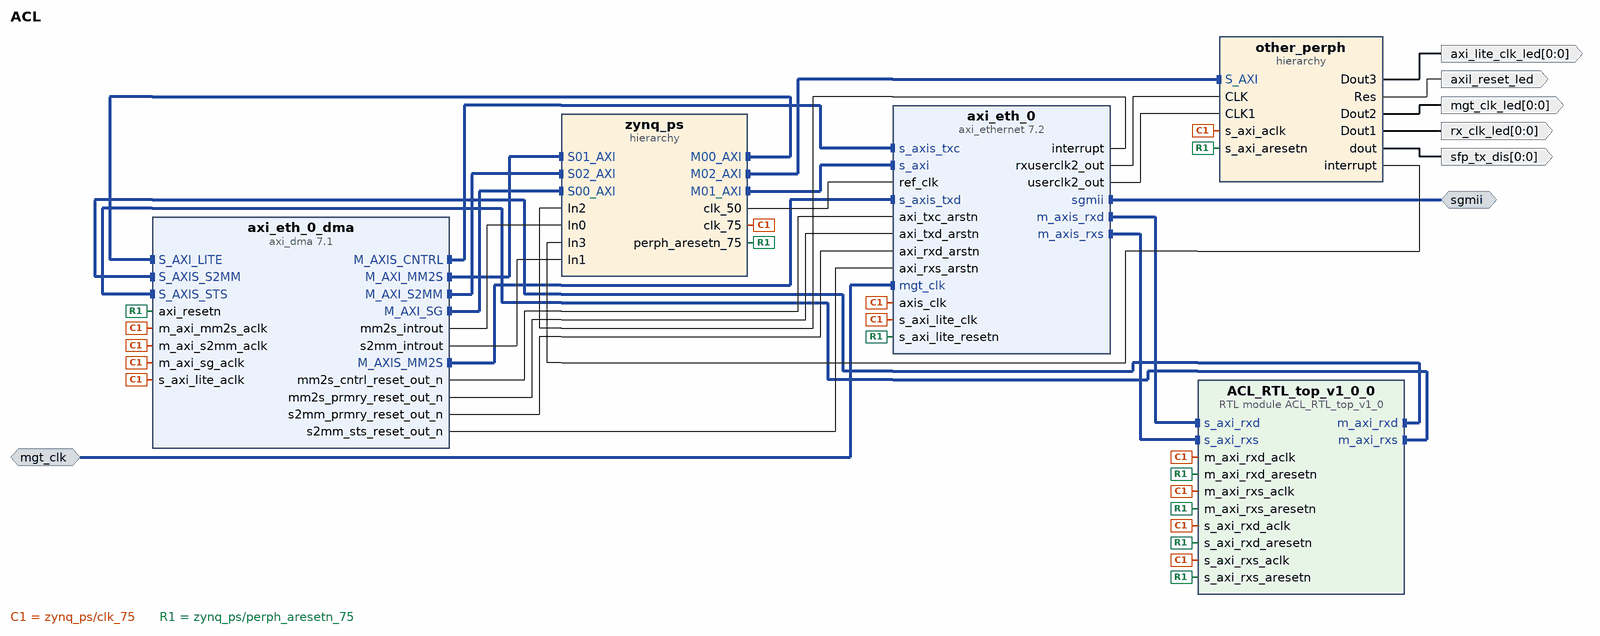
[diagram p0: block diagram of the top level]
# Vivado block design ACL, xczu9eg-ffvb1156-2-e, Vivado 2023.2
create_bd_design ACL

create_bd_intf_port -mode Slave -vlnv xilinx.com:interface:diff_clock_rtl:1.0 mgt_clk
create_bd_intf_port -mode Master -vlnv xilinx.com:interface:sgmii_rtl:1.0 sgmii
create_bd_port -dir O -from 0 -to 0 axi_lite_clk_led
create_bd_port -dir O axil_reset_led
create_bd_port -dir O -from 0 -to 0 mgt_clk_led
create_bd_port -dir O -from 0 -to 0 rx_clk_led
create_bd_port -dir O -from 0 -to 0 sfp_tx_dis

create_bd_cell -type hier other_perph
create_bd_cell -type hier zynq_ps
create_bd_cell -type ip -vlnv xilinx.com:ip:axi_ethernet:7.2 axi_eth_0
set_property -dict [list \
  CONFIG.PHYADDR 2 \
  CONFIG.PHY_TYPE SGMII \
  CONFIG.RXCSUM Full \
  CONFIG.RXMEM 32k \
  CONFIG.Statistics_Reset true \
  CONFIG.TXCSUM Full \
  CONFIG.TXMEM 32k \
  CONFIG.gtlocation X1Y13 \
  CONFIG.gtrefclkrate 156.25 \
] [get_bd_cells axi_eth_0]
create_bd_cell -type ip -vlnv xilinx.com:ip:axi_dma:7.1 axi_eth_0_dma
set_property -dict [list \
  CONFIG.c_include_mm2s_dre 1 \
  CONFIG.c_include_s2mm_dre 1 \
  CONFIG.c_sg_length_width 16 \
  CONFIG.c_sg_use_stsapp_length 1 \
] [get_bd_cells axi_eth_0_dma]
create_bd_cell -type module -reference ACL_RTL_top_v1_0 ACL_RTL_top_v1_0_0

# ---- hierarchy /other_perph ----
current_bd_instance /other_perph
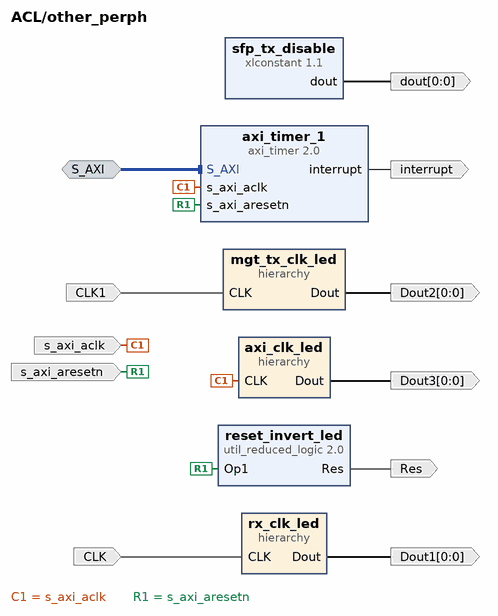
[diagram p1: block diagram inside /other_perph]
create_bd_intf_pin -mode Slave -vlnv xilinx.com:interface:aximm_rtl:1.0 S_AXI
create_bd_pin -dir I -type clk CLK
create_bd_pin -dir I -type clk CLK1
create_bd_pin -dir O -from 0 -to 0 Dout1
create_bd_pin -dir O -from 0 -to 0 Dout2
create_bd_pin -dir O -from 0 -to 0 Dout3
create_bd_pin -dir O Res
create_bd_pin -dir O -from 0 -to 0 dout
create_bd_pin -dir O -type intr interrupt
create_bd_pin -dir I -type clk s_axi_aclk
create_bd_pin -dir I -type rst s_axi_aresetn

create_bd_cell -type hier axi_clk_led
create_bd_cell -type hier mgt_tx_clk_led
create_bd_cell -type ip -vlnv xilinx.com:ip:util_reduced_logic:2.0 reset_invert_led
set_property -dict {CONFIG.C_SIZE 1} [get_bd_cells reset_invert_led]
create_bd_cell -type hier rx_clk_led
create_bd_cell -type ip -vlnv xilinx.com:ip:axi_timer:2.0 axi_timer_1
create_bd_cell -type ip -vlnv xilinx.com:ip:xlconstant:1.1 sfp_tx_disable
set_property -dict {CONFIG.CONST_VAL 1 CONFIG.CONST_WIDTH 1} [get_bd_cells sfp_tx_disable]

# ---- hierarchy /other_perph/axi_clk_led ----
current_bd_instance /other_perph/axi_clk_led
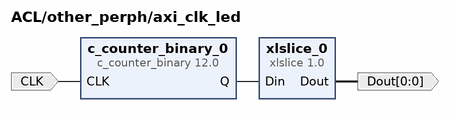
[diagram p2: block diagram inside /other_perph/axi_clk_led]
create_bd_pin -dir I -type clk CLK
create_bd_pin -dir O -from 0 -to 0 Dout

create_bd_cell -type ip -vlnv xilinx.com:ip:xlslice:1.0 xlslice_0
set_property -dict {CONFIG.DIN_FROM 24 CONFIG.DIN_TO 24 CONFIG.DOUT_WIDTH 1} [get_bd_cells xlslice_0]
create_bd_cell -type ip -vlnv xilinx.com:ip:c_counter_binary:12.0 c_counter_binary_0
set_property -dict {CONFIG.Output_Width 32 CONFIG.Restrict_Count false} [get_bd_cells c_counter_binary_0]

# ---- hierarchy /other_perph/mgt_tx_clk_led ----
current_bd_instance /other_perph/mgt_tx_clk_led
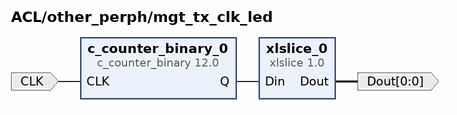
[diagram p3: block diagram inside /other_perph/mgt_tx_clk_led]
create_bd_pin -dir I -type clk CLK
create_bd_pin -dir O -from 0 -to 0 Dout

create_bd_cell -type ip -vlnv xilinx.com:ip:xlslice:1.0 xlslice_0
set_property -dict {CONFIG.DIN_FROM 24 CONFIG.DIN_TO 24 CONFIG.DOUT_WIDTH 1} [get_bd_cells xlslice_0]
create_bd_cell -type ip -vlnv xilinx.com:ip:c_counter_binary:12.0 c_counter_binary_0
set_property -dict {CONFIG.Output_Width 32 CONFIG.Restrict_Count false} [get_bd_cells c_counter_binary_0]

# ---- hierarchy /other_perph/rx_clk_led ----
current_bd_instance /other_perph/rx_clk_led
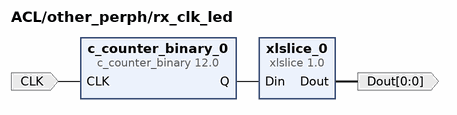
[diagram p4: block diagram inside /other_perph/rx_clk_led]
create_bd_pin -dir I -type clk CLK
create_bd_pin -dir O -from 0 -to 0 Dout

create_bd_cell -type ip -vlnv xilinx.com:ip:xlslice:1.0 xlslice_0
set_property -dict {CONFIG.DIN_FROM 24 CONFIG.DIN_TO 24 CONFIG.DOUT_WIDTH 1} [get_bd_cells xlslice_0]
create_bd_cell -type ip -vlnv xilinx.com:ip:c_counter_binary:12.0 c_counter_binary_0
set_property -dict {CONFIG.Output_Width 32 CONFIG.Restrict_Count false} [get_bd_cells c_counter_binary_0]

# ---- hierarchy /zynq_ps ----
current_bd_instance /zynq_ps
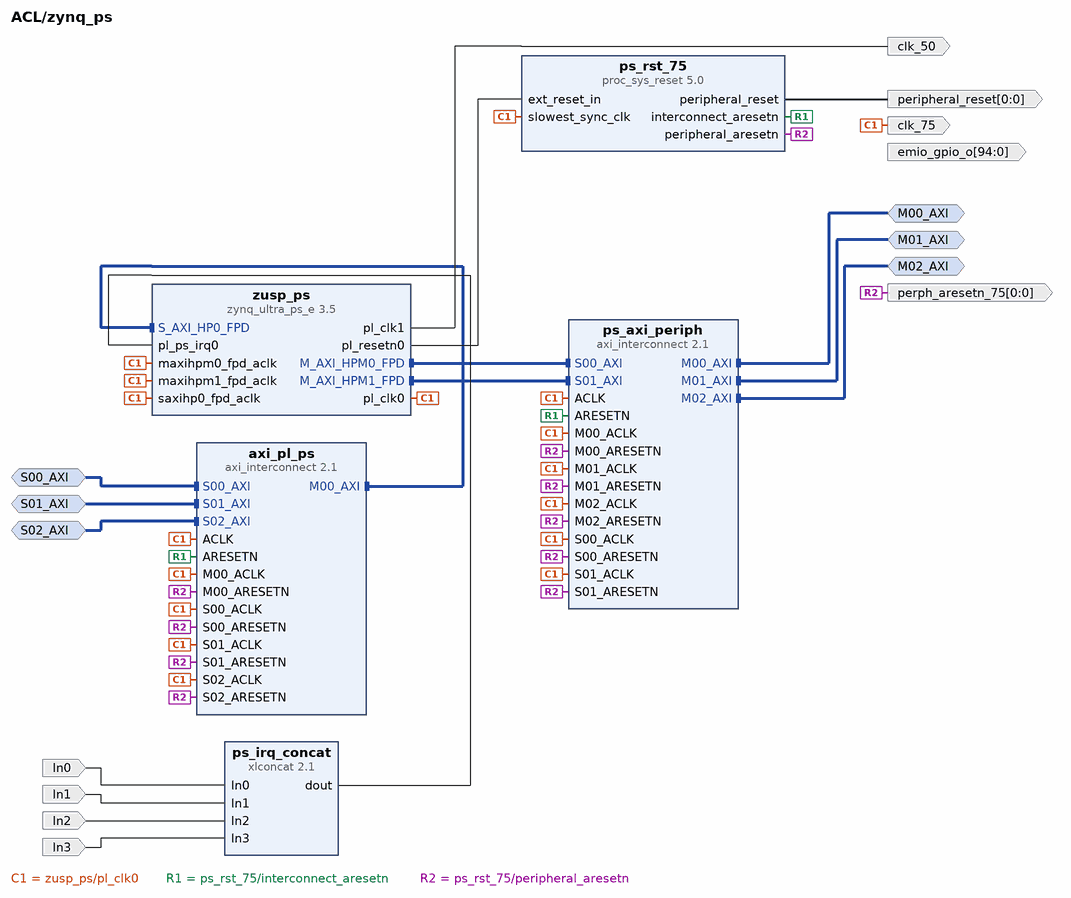
[diagram p5: block diagram inside /zynq_ps]
create_bd_intf_pin -mode Master -vlnv xilinx.com:interface:aximm_rtl:1.0 M00_AXI
create_bd_intf_pin -mode Master -vlnv xilinx.com:interface:aximm_rtl:1.0 M01_AXI
create_bd_intf_pin -mode Master -vlnv xilinx.com:interface:aximm_rtl:1.0 M02_AXI
create_bd_intf_pin -mode Slave -vlnv xilinx.com:interface:aximm_rtl:1.0 S00_AXI
create_bd_intf_pin -mode Slave -vlnv xilinx.com:interface:aximm_rtl:1.0 S01_AXI
create_bd_intf_pin -mode Slave -vlnv xilinx.com:interface:aximm_rtl:1.0 S02_AXI
create_bd_pin -dir I In0
create_bd_pin -dir I In1
create_bd_pin -dir I In2
create_bd_pin -dir I In3
create_bd_pin -dir O -type clk clk_50
create_bd_pin -dir O -type clk clk_75
create_bd_pin -dir O -from 94 -to 0 emio_gpio_o
create_bd_pin -dir O -from 0 -to 0 -type rst peripheral_reset
create_bd_pin -dir O -from 0 -to 0 -type rst perph_aresetn_75

create_bd_cell -type ip -vlnv xilinx.com:ip:xlconcat:2.1 ps_irq_concat
set_property -dict {CONFIG.NUM_PORTS 4} [get_bd_cells ps_irq_concat]
create_bd_cell -type ip -vlnv xilinx.com:ip:proc_sys_reset:5.0 ps_rst_75
create_bd_cell -type ip -vlnv xilinx.com:ip:axi_interconnect:2.1 axi_pl_ps
set_property -dict {CONFIG.NUM_MI 1 CONFIG.NUM_SI 3} [get_bd_cells axi_pl_ps]
create_bd_cell -type ip -vlnv xilinx.com:ip:axi_interconnect:2.1 ps_axi_periph
set_property -dict {CONFIG.NUM_MI 3 CONFIG.NUM_SI 2} [get_bd_cells ps_axi_periph]
create_bd_cell -type ip -vlnv xilinx.com:ip:zynq_ultra_ps_e:3.5 zusp_ps
set_property -dict [list \
  CONFIG.CAN0_BOARD_INTERFACE custom \
  CONFIG.CAN1_BOARD_INTERFACE custom \
  CONFIG.CSU_BOARD_INTERFACE custom \
  CONFIG.DP_BOARD_INTERFACE custom \
  CONFIG.GEM0_BOARD_INTERFACE custom \
  CONFIG.GEM1_BOARD_INTERFACE custom \
  CONFIG.GEM2_BOARD_INTERFACE custom \
  CONFIG.GEM3_BOARD_INTERFACE custom \
  CONFIG.GPIO_BOARD_INTERFACE custom \
  CONFIG.IIC0_BOARD_INTERFACE custom \
  CONFIG.IIC1_BOARD_INTERFACE custom \
  CONFIG.NAND_BOARD_INTERFACE custom \
  CONFIG.PCIE_BOARD_INTERFACE custom \
  CONFIG.PJTAG_BOARD_INTERFACE custom \
  CONFIG.PMU_BOARD_INTERFACE custom \
  CONFIG.PSU_BANK_0_IO_STANDARD LVCMOS18 \
  CONFIG.PSU_BANK_1_IO_STANDARD LVCMOS18 \
  CONFIG.PSU_BANK_2_IO_STANDARD LVCMOS18 \
  CONFIG.PSU_BANK_3_IO_STANDARD LVCMOS18 \
  CONFIG.PSU_DYNAMIC_DDR_CONFIG_EN 1 \
  CONFIG.PSU_USB3__DUAL_CLOCK_ENABLE 1 \
  CONFIG.PSU__CAN1__PERIPHERAL__ENABLE 1 \
  CONFIG.PSU__CAN1__PERIPHERAL__IO {MIO 24 .. 25} \
  CONFIG.PSU__CRF_APB__ACPU_CTRL__FREQMHZ 1200 \
  CONFIG.PSU__CRF_APB__ACPU_CTRL__SRCSEL APLL \
  CONFIG.PSU__CRF_APB__APLL_CTRL__SRCSEL PSS_REF_CLK \
  CONFIG.PSU__CRF_APB__DBG_FPD_CTRL__FREQMHZ 250 \
  CONFIG.PSU__CRF_APB__DBG_FPD_CTRL__SRCSEL IOPLL \
  CONFIG.PSU__CRF_APB__DBG_TRACE_CTRL__FREQMHZ 250 \
  CONFIG.PSU__CRF_APB__DBG_TRACE_CTRL__SRCSEL IOPLL \
  CONFIG.PSU__CRF_APB__DBG_TSTMP_CTRL__FREQMHZ 250 \
  CONFIG.PSU__CRF_APB__DBG_TSTMP_CTRL__SRCSEL IOPLL \
  CONFIG.PSU__CRF_APB__DDR_CTRL__FREQMHZ 1067 \
  CONFIG.PSU__CRF_APB__DDR_CTRL__SRCSEL DPLL \
  CONFIG.PSU__CRF_APB__DPDMA_REF_CTRL__FREQMHZ 600 \
  CONFIG.PSU__CRF_APB__DPDMA_REF_CTRL__SRCSEL APLL \
  CONFIG.PSU__CRF_APB__DPLL_CTRL__SRCSEL PSS_REF_CLK \
  CONFIG.PSU__CRF_APB__DP_AUDIO_REF_CTRL__SRCSEL RPLL \
  CONFIG.PSU__CRF_APB__DP_STC_REF_CTRL__SRCSEL RPLL \
  CONFIG.PSU__CRF_APB__DP_VIDEO_REF_CTRL__SRCSEL VPLL \
  CONFIG.PSU__CRF_APB__GDMA_REF_CTRL__FREQMHZ 600 \
  CONFIG.PSU__CRF_APB__GDMA_REF_CTRL__SRCSEL APLL \
  CONFIG.PSU__CRF_APB__GPU_REF_CTRL__FREQMHZ 500 \
  CONFIG.PSU__CRF_APB__GPU_REF_CTRL__SRCSEL IOPLL \
  CONFIG.PSU__CRF_APB__TOPSW_LSBUS_CTRL__FREQMHZ 100 \
  CONFIG.PSU__CRF_APB__TOPSW_LSBUS_CTRL__SRCSEL IOPLL \
  CONFIG.PSU__CRF_APB__TOPSW_MAIN_CTRL__FREQMHZ 533.33 \
  CONFIG.PSU__CRF_APB__TOPSW_MAIN_CTRL__SRCSEL DPLL \
  CONFIG.PSU__CRF_APB__VPLL_CTRL__SRCSEL PSS_REF_CLK \
  CONFIG.PSU__CRL_APB__ADMA_REF_CTRL__FREQMHZ 500 \
  CONFIG.PSU__CRL_APB__ADMA_REF_CTRL__SRCSEL IOPLL \
  CONFIG.PSU__CRL_APB__CAN1_REF_CTRL__FREQMHZ 100 \
  CONFIG.PSU__CRL_APB__CAN1_REF_CTRL__SRCSEL IOPLL \
  CONFIG.PSU__CRL_APB__CPU_R5_CTRL__FREQMHZ 500 \
  CONFIG.PSU__CRL_APB__CPU_R5_CTRL__SRCSEL IOPLL \
  CONFIG.PSU__CRL_APB__CSU_PLL_CTRL__FREQMHZ 400 \
  CONFIG.PSU__CRL_APB__CSU_PLL_CTRL__SRCSEL RPLL \
  CONFIG.PSU__CRL_APB__DBG_LPD_CTRL__FREQMHZ 250 \
  CONFIG.PSU__CRL_APB__DBG_LPD_CTRL__SRCSEL IOPLL \
  CONFIG.PSU__CRL_APB__GEM3_REF_CTRL__FREQMHZ 125 \
  CONFIG.PSU__CRL_APB__GEM3_REF_CTRL__SRCSEL IOPLL \
  CONFIG.PSU__CRL_APB__I2C0_REF_CTRL__FREQMHZ 100 \
  CONFIG.PSU__CRL_APB__I2C0_REF_CTRL__SRCSEL IOPLL \
  CONFIG.PSU__CRL_APB__I2C1_REF_CTRL__FREQMHZ 100 \
  CONFIG.PSU__CRL_APB__I2C1_REF_CTRL__SRCSEL IOPLL \
  CONFIG.PSU__CRL_APB__IOPLL_CTRL__SRCSEL PSS_REF_CLK \
  CONFIG.PSU__CRL_APB__IOU_SWITCH_CTRL__FREQMHZ 250 \
  CONFIG.PSU__CRL_APB__IOU_SWITCH_CTRL__SRCSEL IOPLL \
  CONFIG.PSU__CRL_APB__LPD_LSBUS_CTRL__FREQMHZ 100 \
  CONFIG.PSU__CRL_APB__LPD_LSBUS_CTRL__SRCSEL IOPLL \
  CONFIG.PSU__CRL_APB__LPD_SWITCH_CTRL__FREQMHZ 500 \
  CONFIG.PSU__CRL_APB__LPD_SWITCH_CTRL__SRCSEL IOPLL \
  CONFIG.PSU__CRL_APB__PCAP_CTRL__FREQMHZ 200 \
  CONFIG.PSU__CRL_APB__PCAP_CTRL__SRCSEL IOPLL \
  CONFIG.PSU__CRL_APB__PL0_REF_CTRL__FREQMHZ 100 \
  CONFIG.PSU__CRL_APB__PL0_REF_CTRL__SRCSEL IOPLL \
  CONFIG.PSU__CRL_APB__PL1_REF_CTRL__FREQMHZ 50 \
  CONFIG.PSU__CRL_APB__QSPI_REF_CTRL__FREQMHZ 125 \
  CONFIG.PSU__CRL_APB__QSPI_REF_CTRL__SRCSEL IOPLL \
  CONFIG.PSU__CRL_APB__RPLL_CTRL__SRCSEL PSS_REF_CLK \
  CONFIG.PSU__CRL_APB__SDIO1_REF_CTRL__FREQMHZ 200 \
  CONFIG.PSU__CRL_APB__SDIO1_REF_CTRL__SRCSEL IOPLL \
  CONFIG.PSU__CRL_APB__TIMESTAMP_REF_CTRL__FREQMHZ 100 \
  CONFIG.PSU__CRL_APB__TIMESTAMP_REF_CTRL__SRCSEL IOPLL \
  CONFIG.PSU__CRL_APB__UART0_REF_CTRL__FREQMHZ 100 \
  CONFIG.PSU__CRL_APB__UART0_REF_CTRL__SRCSEL IOPLL \
  CONFIG.PSU__CRL_APB__UART1_REF_CTRL__FREQMHZ 100 \
  CONFIG.PSU__CRL_APB__UART1_REF_CTRL__SRCSEL IOPLL \
  CONFIG.PSU__CRL_APB__USB0_BUS_REF_CTRL__FREQMHZ 250 \
  CONFIG.PSU__CRL_APB__USB0_BUS_REF_CTRL__SRCSEL IOPLL \
  CONFIG.PSU__CRL_APB__USB3_DUAL_REF_CTRL__FREQMHZ 20 \
  CONFIG.PSU__CRL_APB__USB3_DUAL_REF_CTRL__SRCSEL IOPLL \
  CONFIG.PSU__CRL_APB__USB3__ENABLE 1 \
  CONFIG.PSU__CSUPMU__PERIPHERAL__VALID 1 \
  CONFIG.PSU__DDRC__BUS_WIDTH {64 Bit} \
  CONFIG.PSU__DDRC__COMPONENTS UDIMM \
  CONFIG.PSU__DDRC__DEVICE_CAPACITY {4096 MBits} \
  CONFIG.PSU__DDRC__DRAM_WIDTH {8 Bits} \
  CONFIG.PSU__DDRC__ECC Disabled \
  CONFIG.PSU__DDRC__FREQ_MHZ 1066.50 \
  CONFIG.PSU__DDRC__MEMORY_TYPE {DDR 4} \
  CONFIG.PSU__DDRC__SPEED_BIN DDR4_2133P \
  CONFIG.PSU__DDR_HIGH_ADDRESS_GUI_ENABLE 1 \
  CONFIG.PSU__DDR__INTERFACE__FREQMHZ 533.500 \
  CONFIG.PSU__DEVICE_TYPE EG \
  CONFIG.PSU__DISPLAYPORT__LANE0__ENABLE 1 \
  CONFIG.PSU__DISPLAYPORT__LANE0__IO {GT Lane1} \
  CONFIG.PSU__DISPLAYPORT__LANE1__ENABLE 0 \
  CONFIG.PSU__DISPLAYPORT__PERIPHERAL__ENABLE 1 \
  CONFIG.PSU__DLL__ISUSED 1 \
  CONFIG.PSU__DPAUX__PERIPHERAL__ENABLE 1 \
  CONFIG.PSU__DPAUX__PERIPHERAL__IO {MIO 27 .. 30} \
  CONFIG.PSU__DP__LANE_SEL {Single Lower} \
  CONFIG.PSU__DP__REF_CLK_FREQ 27 \
  CONFIG.PSU__DP__REF_CLK_SEL {Ref Clk3} \
  CONFIG.PSU__ENET3__FIFO__ENABLE 0 \
  CONFIG.PSU__ENET3__GRP_MDIO__ENABLE 1 \
  CONFIG.PSU__ENET3__GRP_MDIO__IO {MIO 76 .. 77} \
  CONFIG.PSU__ENET3__PERIPHERAL__ENABLE 1 \
  CONFIG.PSU__ENET3__PERIPHERAL__IO {MIO 64 .. 75} \
  CONFIG.PSU__ENET3__PTP__ENABLE 0 \
  CONFIG.PSU__ENET3__TSU__ENABLE 0 \
  CONFIG.PSU__EXPAND__LOWER_LPS_SLAVES 1 \
  CONFIG.PSU__FPGA_PL0_ENABLE 1 \
  CONFIG.PSU__FPGA_PL1_ENABLE 1 \
  CONFIG.PSU__GEM3_COHERENCY 0 \
  CONFIG.PSU__GEM3_ROUTE_THROUGH_FPD 0 \
  CONFIG.PSU__GEM__TSU__ENABLE 0 \
  CONFIG.PSU__GPIO0_MIO__IO {MIO 0 .. 25} \
  CONFIG.PSU__GPIO0_MIO__PERIPHERAL__ENABLE 1 \
  CONFIG.PSU__GPIO1_MIO__IO {MIO 26 .. 51} \
  CONFIG.PSU__GPIO1_MIO__PERIPHERAL__ENABLE 1 \
  CONFIG.PSU__GPIO_EMIO_WIDTH 95 \
  CONFIG.PSU__GPIO_EMIO__PERIPHERAL__ENABLE 1 \
  CONFIG.PSU__GPIO_EMIO__PERIPHERAL__IO 95 \
  CONFIG.PSU__GT__LINK_SPEED HBR \
  CONFIG.PSU__GT__PRE_EMPH_LVL_4 0 \
  CONFIG.PSU__GT__VLT_SWNG_LVL_4 0 \
  CONFIG.PSU__I2C0__PERIPHERAL__ENABLE 1 \
  CONFIG.PSU__I2C0__PERIPHERAL__IO {MIO 14 .. 15} \
  CONFIG.PSU__I2C1__PERIPHERAL__ENABLE 1 \
  CONFIG.PSU__I2C1__PERIPHERAL__IO {MIO 16 .. 17} \
  CONFIG.PSU__IOU_SLCR__IOU_TTC_APB_CLK__TTC0_SEL APB \
  CONFIG.PSU__IOU_SLCR__IOU_TTC_APB_CLK__TTC1_SEL APB \
  CONFIG.PSU__IOU_SLCR__IOU_TTC_APB_CLK__TTC2_SEL APB \
  CONFIG.PSU__IOU_SLCR__IOU_TTC_APB_CLK__TTC3_SEL APB \
  CONFIG.PSU__MAXIGP0__DATA_WIDTH 128 \
  CONFIG.PSU__OVERRIDE_HPX_QOS 0 \
  CONFIG.PSU__OVERRIDE__BASIC_CLOCK 0 \
  CONFIG.PSU__PCIE__BAR0_VAL 0x0 \
  CONFIG.PSU__PCIE__BAR1_VAL 0x0 \
  CONFIG.PSU__PCIE__BAR2_VAL 0x0 \
  CONFIG.PSU__PCIE__BAR3_VAL 0x0 \
  CONFIG.PSU__PCIE__BAR4_VAL 0x0 \
  CONFIG.PSU__PCIE__BAR5_VAL 0x0 \
  CONFIG.PSU__PCIE__CLASS_CODE_BASE 0x06 \
  CONFIG.PSU__PCIE__CLASS_CODE_INTERFACE 0x0 \
  CONFIG.PSU__PCIE__CLASS_CODE_SUB 0x4 \
  CONFIG.PSU__PCIE__CLASS_CODE_VALUE 0x60400 \
  CONFIG.PSU__PCIE__CRS_SW_VISIBILITY 1 \
  CONFIG.PSU__PCIE__DEVICE_ID 0xD021 \
  CONFIG.PSU__PCIE__DEVICE_PORT_TYPE {Root Port} \
  CONFIG.PSU__PCIE__EROM_VAL 0x0 \
  CONFIG.PSU__PCIE__LANE0__ENABLE 1 \
  CONFIG.PSU__PCIE__LANE0__IO {GT Lane0} \
  CONFIG.PSU__PCIE__LINK_SPEED {5.0 Gb/s} \
  CONFIG.PSU__PCIE__MAXIMUM_LINK_WIDTH x1 \
  CONFIG.PSU__PCIE__MAX_PAYLOAD_SIZE {256 bytes} \
  CONFIG.PSU__PCIE__PERIPHERAL__ENABLE 1 \
  CONFIG.PSU__PCIE__PERIPHERAL__ENDPOINT_ENABLE 0 \
  CONFIG.PSU__PCIE__PERIPHERAL__ROOTPORT_ENABLE 1 \
  CONFIG.PSU__PCIE__PERIPHERAL__ROOTPORT_IO {MIO 31} \
  CONFIG.PSU__PCIE__REF_CLK_FREQ 100 \
  CONFIG.PSU__PCIE__REF_CLK_SEL {Ref Clk0} \
  CONFIG.PSU__PCIE__REVISION_ID 0x0 \
  CONFIG.PSU__PCIE__SUBSYSTEM_ID 0x7 \
  CONFIG.PSU__PCIE__SUBSYSTEM_VENDOR_ID 0x10EE \
  CONFIG.PSU__PCIE__VENDOR_ID 0x10EE \
  CONFIG.PSU__PMU_COHERENCY 0 \
  CONFIG.PSU__PMU__AIBACK__ENABLE 0 \
  CONFIG.PSU__PMU__EMIO_GPI__ENABLE 0 \
  CONFIG.PSU__PMU__EMIO_GPO__ENABLE 0 \
  CONFIG.PSU__PMU__GPI0__ENABLE 0 \
  CONFIG.PSU__PMU__GPI1__ENABLE 0 \
  CONFIG.PSU__PMU__GPI2__ENABLE 0 \
  CONFIG.PSU__PMU__GPI3__ENABLE 0 \
  CONFIG.PSU__PMU__GPI4__ENABLE 0 \
  CONFIG.PSU__PMU__GPI5__ENABLE 0 \
  CONFIG.PSU__PMU__GPO0__ENABLE 0 \
  CONFIG.PSU__PMU__GPO1__ENABLE 0 \
  CONFIG.PSU__PMU__GPO2__ENABLE 1 \
  CONFIG.PSU__PMU__GPO2__IO {MIO 34} \
  CONFIG.PSU__PMU__GPO2__POLARITY high \
  CONFIG.PSU__PMU__GPO3__ENABLE 0 \
  CONFIG.PSU__PMU__GPO4__ENABLE 0 \
  CONFIG.PSU__PMU__GPO5__ENABLE 0 \
  CONFIG.PSU__PMU__PERIPHERAL__ENABLE 1 \
  CONFIG.PSU__PMU__PLERROR__ENABLE 0 \
  CONFIG.PSU__PRESET_APPLIED 1 \
  CONFIG.PSU__PSS_REF_CLK__FREQMHZ 33.330 \
  CONFIG.PSU__QSPI_COHERENCY 0 \
  CONFIG.PSU__QSPI_ROUTE_THROUGH_FPD 0 \
  CONFIG.PSU__QSPI__GRP_FBCLK__ENABLE 1 \
  CONFIG.PSU__QSPI__GRP_FBCLK__IO {MIO 6} \
  CONFIG.PSU__QSPI__PERIPHERAL__DATA_MODE x4 \
  CONFIG.PSU__QSPI__PERIPHERAL__ENABLE 1 \
  CONFIG.PSU__QSPI__PERIPHERAL__IO {MIO 0 .. 12} \
  CONFIG.PSU__QSPI__PERIPHERAL__MODE {Dual Parallel} \
  CONFIG.PSU__SATA__LANE1__IO {GT Lane3} \
  CONFIG.PSU__SATA__PERIPHERAL__ENABLE 1 \
  CONFIG.PSU__SATA__REF_CLK_FREQ 125 \
  CONFIG.PSU__SATA__REF_CLK_SEL {Ref Clk1} \
  CONFIG.PSU__SD0__CLK_100_SDR_OTAP_DLY 0x3 \
  CONFIG.PSU__SD0__CLK_200_SDR_OTAP_DLY 0x3 \
  CONFIG.PSU__SD0__CLK_50_DDR_ITAP_DLY 0x3D \
  CONFIG.PSU__SD0__CLK_50_DDR_OTAP_DLY 0x4 \
  CONFIG.PSU__SD0__CLK_50_SDR_ITAP_DLY 0x15 \
  CONFIG.PSU__SD0__CLK_50_SDR_OTAP_DLY 0x5 \
  CONFIG.PSU__SD1_COHERENCY 0 \
  CONFIG.PSU__SD1_ROUTE_THROUGH_FPD 0 \
  CONFIG.PSU__SD1__CLK_100_SDR_OTAP_DLY 0x3 \
  CONFIG.PSU__SD1__CLK_200_SDR_OTAP_DLY 0x3 \
  CONFIG.PSU__SD1__CLK_50_DDR_ITAP_DLY 0x3D \
  CONFIG.PSU__SD1__CLK_50_DDR_OTAP_DLY 0x4 \
  CONFIG.PSU__SD1__CLK_50_SDR_ITAP_DLY 0x15 \
  CONFIG.PSU__SD1__CLK_50_SDR_OTAP_DLY 0x5 \
  CONFIG.PSU__SD1__DATA_TRANSFER_MODE 8Bit \
  CONFIG.PSU__SD1__GRP_CD__ENABLE 1 \
  CONFIG.PSU__SD1__GRP_CD__IO {MIO 45} \
  CONFIG.PSU__SD1__GRP_POW__ENABLE 0 \
  CONFIG.PSU__SD1__GRP_WP__ENABLE 1 \
  CONFIG.PSU__SD1__GRP_WP__IO {MIO 44} \
  CONFIG.PSU__SD1__PERIPHERAL__ENABLE 1 \
  CONFIG.PSU__SD1__PERIPHERAL__IO {MIO 39 .. 51} \
  CONFIG.PSU__SD1__SLOT_TYPE {SD 3.0} \
  CONFIG.PSU__SWDT0__CLOCK__ENABLE 0 \
  CONFIG.PSU__SWDT0__PERIPHERAL__ENABLE 1 \
  CONFIG.PSU__SWDT0__RESET__ENABLE 0 \
  CONFIG.PSU__SWDT1__CLOCK__ENABLE 0 \
  CONFIG.PSU__SWDT1__PERIPHERAL__ENABLE 1 \
  CONFIG.PSU__SWDT1__RESET__ENABLE 0 \
  CONFIG.PSU__TSU__BUFG_PORT_PAIR 0 \
  CONFIG.PSU__TTC0__CLOCK__ENABLE 0 \
  CONFIG.PSU__TTC0__PERIPHERAL__ENABLE 1 \
  CONFIG.PSU__TTC0__PERIPHERAL__IO {MIO 6 .. 7} \
  CONFIG.PSU__TTC0__WAVEOUT__ENABLE 0 \
  CONFIG.PSU__TTC1__CLOCK__ENABLE 0 \
  CONFIG.PSU__TTC1__PERIPHERAL__ENABLE 1 \
  CONFIG.PSU__TTC1__PERIPHERAL__IO {MIO 12 .. 13} \
  CONFIG.PSU__TTC1__WAVEOUT__ENABLE 0 \
  CONFIG.PSU__TTC2__CLOCK__ENABLE 0 \
  CONFIG.PSU__TTC2__PERIPHERAL__ENABLE 1 \
  CONFIG.PSU__TTC2__PERIPHERAL__IO {MIO 50 .. 51} \
  CONFIG.PSU__TTC2__WAVEOUT__ENABLE 0 \
  CONFIG.PSU__TTC3__CLOCK__ENABLE 0 \
  CONFIG.PSU__TTC3__PERIPHERAL__ENABLE 1 \
  CONFIG.PSU__TTC3__PERIPHERAL__IO {MIO 56 .. 57} \
  CONFIG.PSU__TTC3__WAVEOUT__ENABLE 0 \
  CONFIG.PSU__UART0__BAUD_RATE 115200 \
  CONFIG.PSU__UART0__MODEM__ENABLE 0 \
  CONFIG.PSU__UART0__PERIPHERAL__ENABLE 1 \
  CONFIG.PSU__UART0__PERIPHERAL__IO {MIO 18 .. 19} \
  CONFIG.PSU__UART1__BAUD_RATE 115200 \
  CONFIG.PSU__UART1__MODEM__ENABLE 0 \
  CONFIG.PSU__UART1__PERIPHERAL__ENABLE 1 \
  CONFIG.PSU__UART1__PERIPHERAL__IO {MIO 20 .. 21} \
  CONFIG.PSU__USB0_COHERENCY 0 \
  CONFIG.PSU__USB0__PERIPHERAL__ENABLE 1 \
  CONFIG.PSU__USB0__PERIPHERAL__IO {MIO 52 .. 63} \
  CONFIG.PSU__USB0__REF_CLK_FREQ 26 \
  CONFIG.PSU__USB0__REF_CLK_SEL {Ref Clk2} \
  CONFIG.PSU__USB2_0__EMIO__ENABLE 0 \
  CONFIG.PSU__USB3_0__EMIO__ENABLE 0 \
  CONFIG.PSU__USB3_0__PERIPHERAL__ENABLE 1 \
  CONFIG.PSU__USB3_0__PERIPHERAL__IO {GT Lane2} \
  CONFIG.PSU__USB__RESET__MODE {Boot Pin} \
  CONFIG.PSU__USB__RESET__POLARITY {Active Low} \
  CONFIG.PSU__USE__IRQ0 1 \
  CONFIG.PSU__USE__M_AXI_GP0 1 \
  CONFIG.PSU__USE__M_AXI_GP1 1 \
  CONFIG.PSU__USE__M_AXI_GP2 0 \
  CONFIG.PSU__USE__S_AXI_GP2 1 \
  CONFIG.QSPI_BOARD_INTERFACE custom \
  CONFIG.SATA_BOARD_INTERFACE custom \
  CONFIG.SD0_BOARD_INTERFACE custom \
  CONFIG.SD1_BOARD_INTERFACE custom \
  CONFIG.SPI0_BOARD_INTERFACE custom \
  CONFIG.SPI1_BOARD_INTERFACE custom \
  CONFIG.SUBPRESET1 Custom \
  CONFIG.SUBPRESET2 Custom \
  CONFIG.SWDT0_BOARD_INTERFACE custom \
  CONFIG.SWDT1_BOARD_INTERFACE custom \
  CONFIG.TRACE_BOARD_INTERFACE custom \
  CONFIG.TTC0_BOARD_INTERFACE custom \
  CONFIG.TTC1_BOARD_INTERFACE custom \
  CONFIG.TTC2_BOARD_INTERFACE custom \
  CONFIG.TTC3_BOARD_INTERFACE custom \
  CONFIG.UART0_BOARD_INTERFACE custom \
  CONFIG.UART1_BOARD_INTERFACE custom \
  CONFIG.USB0_BOARD_INTERFACE custom \
  CONFIG.USB1_BOARD_INTERFACE custom \
] [get_bd_cells zusp_ps]
# 730 more settings of zusp_ps are not shown: defaults, MIO pin electricals, DDR timing, and values the tool derives

# ---- connections ----

current_bd_instance /other_perph
connect_bd_intf_net [get_bd_intf_pins S_AXI] [get_bd_intf_pins axi_timer_1/S_AXI]
connect_bd_net -net CLK1_1 [get_bd_pins CLK1] [get_bd_pins mgt_tx_clk_led/CLK]
connect_bd_net [get_bd_pins CLK] [get_bd_pins rx_clk_led/CLK]
connect_bd_net [get_bd_pins axi_clk_led/Dout] [get_bd_pins Dout3]
connect_bd_net [get_bd_pins axi_timer_1/interrupt] [get_bd_pins interrupt]
connect_bd_net [get_bd_pins mgt_tx_clk_led/Dout] [get_bd_pins Dout2]
connect_bd_net [get_bd_pins reset_invert_led/Res] [get_bd_pins Res]
connect_bd_net [get_bd_pins rx_clk_led/Dout] [get_bd_pins Dout1]
connect_bd_net [get_bd_pins s_axi_aclk] [get_bd_pins axi_clk_led/CLK] [get_bd_pins axi_timer_1/s_axi_aclk]
connect_bd_net [get_bd_pins s_axi_aresetn] [get_bd_pins axi_timer_1/s_axi_aresetn] [get_bd_pins reset_invert_led/Op1]
connect_bd_net [get_bd_pins sfp_tx_disable/dout] [get_bd_pins dout]

current_bd_instance /other_perph/axi_clk_led
connect_bd_net [get_bd_pins CLK] [get_bd_pins c_counter_binary_0/CLK]
connect_bd_net [get_bd_pins c_counter_binary_0/Q] [get_bd_pins xlslice_0/Din]
connect_bd_net [get_bd_pins xlslice_0/Dout] [get_bd_pins Dout]

current_bd_instance /other_perph/mgt_tx_clk_led
connect_bd_net [get_bd_pins CLK] [get_bd_pins c_counter_binary_0/CLK]
connect_bd_net [get_bd_pins c_counter_binary_0/Q] [get_bd_pins xlslice_0/Din]
connect_bd_net [get_bd_pins xlslice_0/Dout] [get_bd_pins Dout]

current_bd_instance /other_perph/rx_clk_led
connect_bd_net [get_bd_pins CLK] [get_bd_pins c_counter_binary_0/CLK]
connect_bd_net [get_bd_pins c_counter_binary_0/Q] [get_bd_pins xlslice_0/Din]
connect_bd_net [get_bd_pins xlslice_0/Dout] [get_bd_pins Dout]

current_bd_instance /zynq_ps
connect_bd_intf_net [get_bd_intf_pins S00_AXI] [get_bd_intf_pins axi_pl_ps/S00_AXI]
connect_bd_intf_net [get_bd_intf_pins ps_axi_periph/S00_AXI] [get_bd_intf_pins zusp_ps/M_AXI_HPM0_FPD]
connect_bd_intf_net [get_bd_intf_pins S01_AXI] [get_bd_intf_pins axi_pl_ps/S01_AXI]
connect_bd_intf_net [get_bd_intf_pins S02_AXI] [get_bd_intf_pins axi_pl_ps/S02_AXI]
connect_bd_intf_net [get_bd_intf_pins axi_pl_ps/M00_AXI] [get_bd_intf_pins zusp_ps/S_AXI_HP0_FPD]
connect_bd_intf_net [get_bd_intf_pins M00_AXI] [get_bd_intf_pins ps_axi_periph/M00_AXI]
connect_bd_intf_net [get_bd_intf_pins M01_AXI] [get_bd_intf_pins ps_axi_periph/M01_AXI]
connect_bd_intf_net [get_bd_intf_pins M02_AXI] [get_bd_intf_pins ps_axi_periph/M02_AXI]
connect_bd_intf_net [get_bd_intf_pins ps_axi_periph/S01_AXI] [get_bd_intf_pins zusp_ps/M_AXI_HPM1_FPD]
connect_bd_net -net ACLK_1 [get_bd_pins zusp_ps/pl_clk0] \
  [get_bd_pins clk_75] [get_bd_pins axi_pl_ps/ACLK] [get_bd_pins axi_pl_ps/S00_ACLK] [get_bd_pins axi_pl_ps/S01_ACLK] \
  [get_bd_pins axi_pl_ps/S02_ACLK] [get_bd_pins axi_pl_ps/M00_ACLK] [get_bd_pins ps_axi_periph/ACLK] \
  [get_bd_pins ps_axi_periph/S00_ACLK] [get_bd_pins ps_axi_periph/S01_ACLK] [get_bd_pins ps_axi_periph/M00_ACLK] \
  [get_bd_pins ps_axi_periph/M01_ACLK] [get_bd_pins ps_axi_periph/M02_ACLK] [get_bd_pins ps_rst_75/slowest_sync_clk] \
  [get_bd_pins zusp_ps/maxihpm0_fpd_aclk] [get_bd_pins zusp_ps/maxihpm1_fpd_aclk] [get_bd_pins zusp_ps/saxihp0_fpd_aclk]
connect_bd_net -net ARESETN_1 [get_bd_pins ps_rst_75/interconnect_aresetn] [get_bd_pins axi_pl_ps/ARESETN] [get_bd_pins ps_axi_periph/ARESETN]
connect_bd_net -net In0_1 [get_bd_pins In0] [get_bd_pins ps_irq_concat/In0]
connect_bd_net -net In1_1 [get_bd_pins In1] [get_bd_pins ps_irq_concat/In1]
connect_bd_net -net In2_1 [get_bd_pins In2] [get_bd_pins ps_irq_concat/In2]
connect_bd_net -net In3_1 [get_bd_pins In3] [get_bd_pins ps_irq_concat/In3]
connect_bd_net -net M00_ARESETN_1 [get_bd_pins ps_rst_75/peripheral_aresetn] \
  [get_bd_pins perph_aresetn_75] [get_bd_pins axi_pl_ps/S00_ARESETN] [get_bd_pins axi_pl_ps/S01_ARESETN] \
  [get_bd_pins axi_pl_ps/S02_ARESETN] [get_bd_pins axi_pl_ps/M00_ARESETN] [get_bd_pins ps_axi_periph/S00_ARESETN] \
  [get_bd_pins ps_axi_periph/S01_ARESETN] [get_bd_pins ps_axi_periph/M00_ARESETN] [get_bd_pins ps_axi_periph/M01_ARESETN] \
  [get_bd_pins ps_axi_periph/M02_ARESETN]
connect_bd_net [get_bd_pins ps_irq_concat/dout] [get_bd_pins zusp_ps/pl_ps_irq0]
connect_bd_net [get_bd_pins ps_rst_75/peripheral_reset] [get_bd_pins peripheral_reset]
connect_bd_net [get_bd_pins zusp_ps/pl_clk1] [get_bd_pins clk_50]
connect_bd_net [get_bd_pins zusp_ps/pl_resetn0] [get_bd_pins ps_rst_75/ext_reset_in]

current_bd_instance /
connect_bd_intf_net [get_bd_intf_pins ACL_RTL_top_v1_0_0/m_axi_rxd] [get_bd_intf_pins axi_eth_0_dma/S_AXIS_S2MM]
connect_bd_intf_net [get_bd_intf_pins ACL_RTL_top_v1_0_0/m_axi_rxs] [get_bd_intf_pins axi_eth_0_dma/S_AXIS_STS]
connect_bd_intf_net [get_bd_intf_pins other_perph/S_AXI] [get_bd_intf_pins zynq_ps/M02_AXI]
connect_bd_intf_net [get_bd_intf_pins axi_eth_0/s_axis_txc] [get_bd_intf_pins axi_eth_0_dma/M_AXIS_CNTRL]
connect_bd_intf_net [get_bd_intf_pins axi_eth_0/s_axis_txd] [get_bd_intf_pins axi_eth_0_dma/M_AXIS_MM2S]
connect_bd_intf_net [get_bd_intf_pins axi_eth_0_dma/M_AXI_MM2S] [get_bd_intf_pins zynq_ps/S01_AXI]
connect_bd_intf_net [get_bd_intf_pins axi_eth_0_dma/M_AXI_S2MM] [get_bd_intf_pins zynq_ps/S02_AXI]
connect_bd_intf_net [get_bd_intf_pins axi_eth_0_dma/M_AXI_SG] [get_bd_intf_pins zynq_ps/S00_AXI]
connect_bd_intf_net [get_bd_intf_pins axi_eth_0/m_axis_rxd] [get_bd_intf_pins ACL_RTL_top_v1_0_0/s_axi_rxd]
connect_bd_intf_net [get_bd_intf_pins ACL_RTL_top_v1_0_0/s_axi_rxs] [get_bd_intf_pins axi_eth_0/m_axis_rxs]
connect_bd_intf_net [get_bd_intf_ports sgmii] [get_bd_intf_pins axi_eth_0/sgmii]
connect_bd_intf_net [get_bd_intf_ports mgt_clk] [get_bd_intf_pins axi_eth_0/mgt_clk]
connect_bd_intf_net [get_bd_intf_pins axi_eth_0_dma/S_AXI_LITE] [get_bd_intf_pins zynq_ps/M00_AXI]
connect_bd_intf_net [get_bd_intf_pins axi_eth_0/s_axi] [get_bd_intf_pins zynq_ps/M01_AXI]
connect_bd_net [get_bd_pins axi_eth_0_dma/mm2s_cntrl_reset_out_n] [get_bd_pins axi_eth_0/axi_txc_arstn]
connect_bd_net [get_bd_pins axi_eth_0_dma/mm2s_introut] [get_bd_pins zynq_ps/In0]
connect_bd_net [get_bd_pins axi_eth_0_dma/mm2s_prmry_reset_out_n] [get_bd_pins axi_eth_0/axi_txd_arstn]
connect_bd_net [get_bd_pins axi_eth_0_dma/s2mm_introut] [get_bd_pins zynq_ps/In1]
connect_bd_net [get_bd_pins axi_eth_0_dma/s2mm_prmry_reset_out_n] [get_bd_pins axi_eth_0/axi_rxd_arstn]
connect_bd_net [get_bd_pins axi_eth_0_dma/s2mm_sts_reset_out_n] [get_bd_pins axi_eth_0/axi_rxs_arstn]
connect_bd_net [get_bd_pins axi_eth_0/interrupt] [get_bd_pins zynq_ps/In2]
connect_bd_net [get_bd_pins axi_eth_0/rxuserclk2_out] [get_bd_pins other_perph/CLK]
connect_bd_net [get_bd_pins axi_eth_0/userclk2_out] [get_bd_pins other_perph/CLK1]
connect_bd_net [get_bd_pins other_perph/Dout1] [get_bd_ports rx_clk_led]
connect_bd_net [get_bd_pins other_perph/Dout2] [get_bd_ports mgt_clk_led]
connect_bd_net [get_bd_pins other_perph/Dout3] [get_bd_ports axi_lite_clk_led]
connect_bd_net [get_bd_pins other_perph/Res] [get_bd_ports axil_reset_led]
connect_bd_net [get_bd_pins other_perph/dout] [get_bd_ports sfp_tx_dis]
connect_bd_net [get_bd_pins other_perph/interrupt] [get_bd_pins zynq_ps/In3]
connect_bd_net -net s_axi_aclk_1 [get_bd_pins zynq_ps/clk_75] \
  [get_bd_pins other_perph/s_axi_aclk] [get_bd_pins axi_eth_0/s_axi_lite_clk] [get_bd_pins axi_eth_0/axis_clk] \
  [get_bd_pins axi_eth_0_dma/s_axi_lite_aclk] [get_bd_pins axi_eth_0_dma/m_axi_sg_aclk] \
  [get_bd_pins axi_eth_0_dma/m_axi_mm2s_aclk] [get_bd_pins axi_eth_0_dma/m_axi_s2mm_aclk] \
  [get_bd_pins ACL_RTL_top_v1_0_0/s_axi_rxd_aclk] [get_bd_pins ACL_RTL_top_v1_0_0/s_axi_rxs_aclk] \
  [get_bd_pins ACL_RTL_top_v1_0_0/m_axi_rxd_aclk] [get_bd_pins ACL_RTL_top_v1_0_0/m_axi_rxs_aclk]
connect_bd_net -net s_axi_aresetn_1 [get_bd_pins zynq_ps/perph_aresetn_75] \
  [get_bd_pins other_perph/s_axi_aresetn] [get_bd_pins axi_eth_0/s_axi_lite_resetn] [get_bd_pins axi_eth_0_dma/axi_resetn] \
  [get_bd_pins ACL_RTL_top_v1_0_0/s_axi_rxd_aresetn] [get_bd_pins ACL_RTL_top_v1_0_0/s_axi_rxs_aresetn] \
  [get_bd_pins ACL_RTL_top_v1_0_0/m_axi_rxd_aresetn] [get_bd_pins ACL_RTL_top_v1_0_0/m_axi_rxs_aresetn]
connect_bd_net [get_bd_pins zynq_ps/clk_50] [get_bd_pins axi_eth_0/ref_clk]

# ---- address map ----
assign_bd_address -offset 0x00000000 -range 2G -target_address_space [get_bd_addr_spaces axi_eth_0_dma/Data_MM2S] [get_bd_addr_segs zynq_ps/zusp_ps/SAXIGP2/HP0_DDR_LOW]
assign_bd_address -offset 0xC0000000 -range 512M -target_address_space [get_bd_addr_spaces axi_eth_0_dma/Data_MM2S] [get_bd_addr_segs zynq_ps/zusp_ps/SAXIGP2/HP0_QSPI]
assign_bd_address -offset 0xE0000000 -range 256M -target_address_space [get_bd_addr_spaces axi_eth_0_dma/Data_MM2S] [get_bd_addr_segs zynq_ps/zusp_ps/SAXIGP2/HP0_PCIE_LOW]
assign_bd_address -offset 0xFFFC0000 -range 256K -target_address_space [get_bd_addr_spaces axi_eth_0_dma/Data_MM2S] [get_bd_addr_segs zynq_ps/zusp_ps/SAXIGP2/HP0_OCM]
exclude_bd_addr_seg -offset 0x00000000 -range 1 -target_address_space [get_bd_addr_spaces axi_eth_0_dma/Data_MM2S] [get_bd_addr_segs zynq_ps/zusp_ps/SAXIGP2/HP0_DDR_HIGH]
exclude_bd_addr_seg -offset 0xFF000000 -range 64K -target_address_space [get_bd_addr_spaces axi_eth_0_dma/Data_MM2S] [get_bd_addr_segs zynq_ps/zusp_ps/SAXIGP2/HP0_UART0]
exclude_bd_addr_seg -offset 0xFF010000 -range 64K -target_address_space [get_bd_addr_spaces axi_eth_0_dma/Data_MM2S] [get_bd_addr_segs zynq_ps/zusp_ps/SAXIGP2/HP0_UART1]
exclude_bd_addr_seg -offset 0xFF020000 -range 64K -target_address_space [get_bd_addr_spaces axi_eth_0_dma/Data_MM2S] [get_bd_addr_segs zynq_ps/zusp_ps/SAXIGP2/HP0_I2C0]
exclude_bd_addr_seg -offset 0xFF030000 -range 64K -target_address_space [get_bd_addr_spaces axi_eth_0_dma/Data_MM2S] [get_bd_addr_segs zynq_ps/zusp_ps/SAXIGP2/HP0_I2C1]
exclude_bd_addr_seg -offset 0xFF070000 -range 64K -target_address_space [get_bd_addr_spaces axi_eth_0_dma/Data_MM2S] [get_bd_addr_segs zynq_ps/zusp_ps/SAXIGP2/HP0_CAN1]
exclude_bd_addr_seg -offset 0xFF0A0000 -range 64K -target_address_space [get_bd_addr_spaces axi_eth_0_dma/Data_MM2S] [get_bd_addr_segs zynq_ps/zusp_ps/SAXIGP2/HP0_GPIO]
exclude_bd_addr_seg -offset 0xFF0E0000 -range 64K -target_address_space [get_bd_addr_spaces axi_eth_0_dma/Data_MM2S] [get_bd_addr_segs zynq_ps/zusp_ps/SAXIGP2/HP0_GEM3]
exclude_bd_addr_seg -offset 0xFF0F0000 -range 64K -target_address_space [get_bd_addr_spaces axi_eth_0_dma/Data_MM2S] [get_bd_addr_segs zynq_ps/zusp_ps/SAXIGP2/HP0_QSPI_CTRL]
exclude_bd_addr_seg -offset 0xFF110000 -range 64K -target_address_space [get_bd_addr_spaces axi_eth_0_dma/Data_MM2S] [get_bd_addr_segs zynq_ps/zusp_ps/SAXIGP2/HP0_TTC0]
exclude_bd_addr_seg -offset 0xFF120000 -range 64K -target_address_space [get_bd_addr_spaces axi_eth_0_dma/Data_MM2S] [get_bd_addr_segs zynq_ps/zusp_ps/SAXIGP2/HP0_TTC1]
exclude_bd_addr_seg -offset 0xFF130000 -range 64K -target_address_space [get_bd_addr_spaces axi_eth_0_dma/Data_MM2S] [get_bd_addr_segs zynq_ps/zusp_ps/SAXIGP2/HP0_TTC2]
exclude_bd_addr_seg -offset 0xFF140000 -range 64K -target_address_space [get_bd_addr_spaces axi_eth_0_dma/Data_MM2S] [get_bd_addr_segs zynq_ps/zusp_ps/SAXIGP2/HP0_TTC3]
exclude_bd_addr_seg -offset 0xFF150000 -range 64K -target_address_space [get_bd_addr_spaces axi_eth_0_dma/Data_MM2S] [get_bd_addr_segs zynq_ps/zusp_ps/SAXIGP2/HP0_SWDT]
exclude_bd_addr_seg -offset 0xFF170000 -range 64K -target_address_space [get_bd_addr_spaces axi_eth_0_dma/Data_MM2S] [get_bd_addr_segs zynq_ps/zusp_ps/SAXIGP2/HP0_SD1]
exclude_bd_addr_seg -offset 0xFF180000 -range 512K -target_address_space [get_bd_addr_spaces axi_eth_0_dma/Data_MM2S] [get_bd_addr_segs zynq_ps/zusp_ps/SAXIGP2/HP0_IOUSLCR]
exclude_bd_addr_seg -offset 0xFF240000 -range 64K -target_address_space [get_bd_addr_spaces axi_eth_0_dma/Data_MM2S] [get_bd_addr_segs zynq_ps/zusp_ps/SAXIGP2/HP0_IOU_SECURE_SLCR]
exclude_bd_addr_seg -offset 0xFF250000 -range 64K -target_address_space [get_bd_addr_spaces axi_eth_0_dma/Data_MM2S] [get_bd_addr_segs zynq_ps/zusp_ps/SAXIGP2/HP0_IOU_SCNTR]
exclude_bd_addr_seg -offset 0xFF260000 -range 64K -target_address_space [get_bd_addr_spaces axi_eth_0_dma/Data_MM2S] [get_bd_addr_segs zynq_ps/zusp_ps/SAXIGP2/HP0_IOU_SCNTRS]
exclude_bd_addr_seg -offset 0xFF300000 -range 1M -target_address_space [get_bd_addr_spaces axi_eth_0_dma/Data_MM2S] [get_bd_addr_segs zynq_ps/zusp_ps/SAXIGP2/HP0_IPI]
exclude_bd_addr_seg -offset 0xFF400000 -range 1M -target_address_space [get_bd_addr_spaces axi_eth_0_dma/Data_MM2S] [get_bd_addr_segs zynq_ps/zusp_ps/SAXIGP2/HP0_LPD_SLCR]
exclude_bd_addr_seg -offset 0xFF960000 -range 64K -target_address_space [get_bd_addr_spaces axi_eth_0_dma/Data_MM2S] [get_bd_addr_segs zynq_ps/zusp_ps/SAXIGP2/HP0_OCM_CTRL]
exclude_bd_addr_seg -offset 0xFF980000 -range 64K -target_address_space [get_bd_addr_spaces axi_eth_0_dma/Data_MM2S] [get_bd_addr_segs zynq_ps/zusp_ps/SAXIGP2/HP0_LPD_XPPU]
exclude_bd_addr_seg -offset 0xFF990000 -range 64K -target_address_space [get_bd_addr_spaces axi_eth_0_dma/Data_MM2S] [get_bd_addr_segs zynq_ps/zusp_ps/SAXIGP2/HP0_IPI_BUFFERS]
exclude_bd_addr_seg -offset 0xFF9A0000 -range 64K -target_address_space [get_bd_addr_spaces axi_eth_0_dma/Data_MM2S] [get_bd_addr_segs zynq_ps/zusp_ps/SAXIGP2/HP0_RPU]
exclude_bd_addr_seg -offset 0xFF9B0000 -range 64K -target_address_space [get_bd_addr_spaces axi_eth_0_dma/Data_MM2S] [get_bd_addr_segs zynq_ps/zusp_ps/SAXIGP2/HP0_AFIFM6]
exclude_bd_addr_seg -offset 0xFF9C0000 -range 64K -target_address_space [get_bd_addr_spaces axi_eth_0_dma/Data_MM2S] [get_bd_addr_segs zynq_ps/zusp_ps/SAXIGP2/HP0_LPD_XPPU_SINK]
exclude_bd_addr_seg -offset 0xFF9D0000 -range 64K -target_address_space [get_bd_addr_spaces axi_eth_0_dma/Data_MM2S] [get_bd_addr_segs zynq_ps/zusp_ps/SAXIGP2/HP0_USB0]
exclude_bd_addr_seg -offset 0xFFA00000 -range 256K -target_address_space [get_bd_addr_spaces axi_eth_0_dma/Data_MM2S] [get_bd_addr_segs zynq_ps/zusp_ps/SAXIGP2/HP0_APM]
exclude_bd_addr_seg -offset 0xFFA50000 -range 64K -target_address_space [get_bd_addr_spaces axi_eth_0_dma/Data_MM2S] [get_bd_addr_segs zynq_ps/zusp_ps/SAXIGP2/HP0_AMS]
exclude_bd_addr_seg -offset 0xFFA60000 -range 64K -target_address_space [get_bd_addr_spaces axi_eth_0_dma/Data_MM2S] [get_bd_addr_segs zynq_ps/zusp_ps/SAXIGP2/HP0_RTC]
exclude_bd_addr_seg -offset 0xFFA70000 -range 64K -target_address_space [get_bd_addr_spaces axi_eth_0_dma/Data_MM2S] [get_bd_addr_segs zynq_ps/zusp_ps/SAXIGP2/HP0_OCM_XMPU_CFG]
exclude_bd_addr_seg -offset 0xFFA80000 -range 512K -target_address_space [get_bd_addr_spaces axi_eth_0_dma/Data_MM2S] [get_bd_addr_segs zynq_ps/zusp_ps/SAXIGP2/HP0_LDMA]
exclude_bd_addr_seg -offset 0xFFC80000 -range 128K -target_address_space [get_bd_addr_spaces axi_eth_0_dma/Data_MM2S] [get_bd_addr_segs zynq_ps/zusp_ps/SAXIGP2/HP0_CSUDMA]
exclude_bd_addr_seg -offset 0xFFCA0000 -range 64K -target_address_space [get_bd_addr_spaces axi_eth_0_dma/Data_MM2S] [get_bd_addr_segs zynq_ps/zusp_ps/SAXIGP2/HP0_CSU]
exclude_bd_addr_seg -offset 0xFFCC0000 -range 64K -target_address_space [get_bd_addr_spaces axi_eth_0_dma/Data_MM2S] [get_bd_addr_segs zynq_ps/zusp_ps/SAXIGP2/HP0_EFUSE]
exclude_bd_addr_seg -offset 0xFFCE0000 -range 64K -target_address_space [get_bd_addr_spaces axi_eth_0_dma/Data_MM2S] [get_bd_addr_segs zynq_ps/zusp_ps/SAXIGP2/HP0_RSA]
exclude_bd_addr_seg -offset 0xFFCF0000 -range 64K -target_address_space [get_bd_addr_spaces axi_eth_0_dma/Data_MM2S] [get_bd_addr_segs zynq_ps/zusp_ps/SAXIGP2/HP0_MBISTJTAG]
exclude_bd_addr_seg -offset 0xFFD80000 -range 256K -target_address_space [get_bd_addr_spaces axi_eth_0_dma/Data_MM2S] [get_bd_addr_segs zynq_ps/zusp_ps/SAXIGP2/HP0_PMU_GLOBAL]
assign_bd_address -offset 0x00000000 -range 2G -target_address_space [get_bd_addr_spaces axi_eth_0_dma/Data_S2MM] [get_bd_addr_segs zynq_ps/zusp_ps/SAXIGP2/HP0_DDR_LOW]
assign_bd_address -offset 0xC0000000 -range 512M -target_address_space [get_bd_addr_spaces axi_eth_0_dma/Data_S2MM] [get_bd_addr_segs zynq_ps/zusp_ps/SAXIGP2/HP0_QSPI]
assign_bd_address -offset 0xE0000000 -range 256M -target_address_space [get_bd_addr_spaces axi_eth_0_dma/Data_S2MM] [get_bd_addr_segs zynq_ps/zusp_ps/SAXIGP2/HP0_PCIE_LOW]
assign_bd_address -offset 0xFFFC0000 -range 256K -target_address_space [get_bd_addr_spaces axi_eth_0_dma/Data_S2MM] [get_bd_addr_segs zynq_ps/zusp_ps/SAXIGP2/HP0_OCM]
exclude_bd_addr_seg -offset 0x00000000 -range 1 -target_address_space [get_bd_addr_spaces axi_eth_0_dma/Data_S2MM] [get_bd_addr_segs zynq_ps/zusp_ps/SAXIGP2/HP0_DDR_HIGH]
exclude_bd_addr_seg -offset 0xFF000000 -range 64K -target_address_space [get_bd_addr_spaces axi_eth_0_dma/Data_S2MM] [get_bd_addr_segs zynq_ps/zusp_ps/SAXIGP2/HP0_UART0]
exclude_bd_addr_seg -offset 0xFF010000 -range 64K -target_address_space [get_bd_addr_spaces axi_eth_0_dma/Data_S2MM] [get_bd_addr_segs zynq_ps/zusp_ps/SAXIGP2/HP0_UART1]
exclude_bd_addr_seg -offset 0xFF020000 -range 64K -target_address_space [get_bd_addr_spaces axi_eth_0_dma/Data_S2MM] [get_bd_addr_segs zynq_ps/zusp_ps/SAXIGP2/HP0_I2C0]
exclude_bd_addr_seg -offset 0xFF030000 -range 64K -target_address_space [get_bd_addr_spaces axi_eth_0_dma/Data_S2MM] [get_bd_addr_segs zynq_ps/zusp_ps/SAXIGP2/HP0_I2C1]
exclude_bd_addr_seg -offset 0xFF070000 -range 64K -target_address_space [get_bd_addr_spaces axi_eth_0_dma/Data_S2MM] [get_bd_addr_segs zynq_ps/zusp_ps/SAXIGP2/HP0_CAN1]
exclude_bd_addr_seg -offset 0xFF0A0000 -range 64K -target_address_space [get_bd_addr_spaces axi_eth_0_dma/Data_S2MM] [get_bd_addr_segs zynq_ps/zusp_ps/SAXIGP2/HP0_GPIO]
exclude_bd_addr_seg -offset 0xFF0E0000 -range 64K -target_address_space [get_bd_addr_spaces axi_eth_0_dma/Data_S2MM] [get_bd_addr_segs zynq_ps/zusp_ps/SAXIGP2/HP0_GEM3]
exclude_bd_addr_seg -offset 0xFF0F0000 -range 64K -target_address_space [get_bd_addr_spaces axi_eth_0_dma/Data_S2MM] [get_bd_addr_segs zynq_ps/zusp_ps/SAXIGP2/HP0_QSPI_CTRL]
exclude_bd_addr_seg -offset 0xFF110000 -range 64K -target_address_space [get_bd_addr_spaces axi_eth_0_dma/Data_S2MM] [get_bd_addr_segs zynq_ps/zusp_ps/SAXIGP2/HP0_TTC0]
exclude_bd_addr_seg -offset 0xFF120000 -range 64K -target_address_space [get_bd_addr_spaces axi_eth_0_dma/Data_S2MM] [get_bd_addr_segs zynq_ps/zusp_ps/SAXIGP2/HP0_TTC1]
exclude_bd_addr_seg -offset 0xFF130000 -range 64K -target_address_space [get_bd_addr_spaces axi_eth_0_dma/Data_S2MM] [get_bd_addr_segs zynq_ps/zusp_ps/SAXIGP2/HP0_TTC2]
exclude_bd_addr_seg -offset 0xFF140000 -range 64K -target_address_space [get_bd_addr_spaces axi_eth_0_dma/Data_S2MM] [get_bd_addr_segs zynq_ps/zusp_ps/SAXIGP2/HP0_TTC3]
exclude_bd_addr_seg -offset 0xFF150000 -range 64K -target_address_space [get_bd_addr_spaces axi_eth_0_dma/Data_S2MM] [get_bd_addr_segs zynq_ps/zusp_ps/SAXIGP2/HP0_SWDT]
exclude_bd_addr_seg -offset 0xFF170000 -range 64K -target_address_space [get_bd_addr_spaces axi_eth_0_dma/Data_S2MM] [get_bd_addr_segs zynq_ps/zusp_ps/SAXIGP2/HP0_SD1]
exclude_bd_addr_seg -offset 0xFF180000 -range 512K -target_address_space [get_bd_addr_spaces axi_eth_0_dma/Data_S2MM] [get_bd_addr_segs zynq_ps/zusp_ps/SAXIGP2/HP0_IOUSLCR]
exclude_bd_addr_seg -offset 0xFF240000 -range 64K -target_address_space [get_bd_addr_spaces axi_eth_0_dma/Data_S2MM] [get_bd_addr_segs zynq_ps/zusp_ps/SAXIGP2/HP0_IOU_SECURE_SLCR]
exclude_bd_addr_seg -offset 0xFF250000 -range 64K -target_address_space [get_bd_addr_spaces axi_eth_0_dma/Data_S2MM] [get_bd_addr_segs zynq_ps/zusp_ps/SAXIGP2/HP0_IOU_SCNTR]
exclude_bd_addr_seg -offset 0xFF260000 -range 64K -target_address_space [get_bd_addr_spaces axi_eth_0_dma/Data_S2MM] [get_bd_addr_segs zynq_ps/zusp_ps/SAXIGP2/HP0_IOU_SCNTRS]
exclude_bd_addr_seg -offset 0xFF300000 -range 1M -target_address_space [get_bd_addr_spaces axi_eth_0_dma/Data_S2MM] [get_bd_addr_segs zynq_ps/zusp_ps/SAXIGP2/HP0_IPI]
exclude_bd_addr_seg -offset 0xFF400000 -range 1M -target_address_space [get_bd_addr_spaces axi_eth_0_dma/Data_S2MM] [get_bd_addr_segs zynq_ps/zusp_ps/SAXIGP2/HP0_LPD_SLCR]
exclude_bd_addr_seg -offset 0xFF960000 -range 64K -target_address_space [get_bd_addr_spaces axi_eth_0_dma/Data_S2MM] [get_bd_addr_segs zynq_ps/zusp_ps/SAXIGP2/HP0_OCM_CTRL]
exclude_bd_addr_seg -offset 0xFF980000 -range 64K -target_address_space [get_bd_addr_spaces axi_eth_0_dma/Data_S2MM] [get_bd_addr_segs zynq_ps/zusp_ps/SAXIGP2/HP0_LPD_XPPU]
exclude_bd_addr_seg -offset 0xFF990000 -range 64K -target_address_space [get_bd_addr_spaces axi_eth_0_dma/Data_S2MM] [get_bd_addr_segs zynq_ps/zusp_ps/SAXIGP2/HP0_IPI_BUFFERS]
exclude_bd_addr_seg -offset 0xFF9A0000 -range 64K -target_address_space [get_bd_addr_spaces axi_eth_0_dma/Data_S2MM] [get_bd_addr_segs zynq_ps/zusp_ps/SAXIGP2/HP0_RPU]
exclude_bd_addr_seg -offset 0xFF9B0000 -range 64K -target_address_space [get_bd_addr_spaces axi_eth_0_dma/Data_S2MM] [get_bd_addr_segs zynq_ps/zusp_ps/SAXIGP2/HP0_AFIFM6]
exclude_bd_addr_seg -offset 0xFF9C0000 -range 64K -target_address_space [get_bd_addr_spaces axi_eth_0_dma/Data_S2MM] [get_bd_addr_segs zynq_ps/zusp_ps/SAXIGP2/HP0_LPD_XPPU_SINK]
exclude_bd_addr_seg -offset 0xFF9D0000 -range 64K -target_address_space [get_bd_addr_spaces axi_eth_0_dma/Data_S2MM] [get_bd_addr_segs zynq_ps/zusp_ps/SAXIGP2/HP0_USB0]
exclude_bd_addr_seg -offset 0xFFA00000 -range 256K -target_address_space [get_bd_addr_spaces axi_eth_0_dma/Data_S2MM] [get_bd_addr_segs zynq_ps/zusp_ps/SAXIGP2/HP0_APM]
exclude_bd_addr_seg -offset 0xFFA50000 -range 64K -target_address_space [get_bd_addr_spaces axi_eth_0_dma/Data_S2MM] [get_bd_addr_segs zynq_ps/zusp_ps/SAXIGP2/HP0_AMS]
exclude_bd_addr_seg -offset 0xFFA60000 -range 64K -target_address_space [get_bd_addr_spaces axi_eth_0_dma/Data_S2MM] [get_bd_addr_segs zynq_ps/zusp_ps/SAXIGP2/HP0_RTC]
exclude_bd_addr_seg -offset 0xFFA70000 -range 64K -target_address_space [get_bd_addr_spaces axi_eth_0_dma/Data_S2MM] [get_bd_addr_segs zynq_ps/zusp_ps/SAXIGP2/HP0_OCM_XMPU_CFG]
exclude_bd_addr_seg -offset 0xFFA80000 -range 512K -target_address_space [get_bd_addr_spaces axi_eth_0_dma/Data_S2MM] [get_bd_addr_segs zynq_ps/zusp_ps/SAXIGP2/HP0_LDMA]
exclude_bd_addr_seg -offset 0xFFC80000 -range 128K -target_address_space [get_bd_addr_spaces axi_eth_0_dma/Data_S2MM] [get_bd_addr_segs zynq_ps/zusp_ps/SAXIGP2/HP0_CSUDMA]
exclude_bd_addr_seg -offset 0xFFCA0000 -range 64K -target_address_space [get_bd_addr_spaces axi_eth_0_dma/Data_S2MM] [get_bd_addr_segs zynq_ps/zusp_ps/SAXIGP2/HP0_CSU]
exclude_bd_addr_seg -offset 0xFFCC0000 -range 64K -target_address_space [get_bd_addr_spaces axi_eth_0_dma/Data_S2MM] [get_bd_addr_segs zynq_ps/zusp_ps/SAXIGP2/HP0_EFUSE]
exclude_bd_addr_seg -offset 0xFFCE0000 -range 64K -target_address_space [get_bd_addr_spaces axi_eth_0_dma/Data_S2MM] [get_bd_addr_segs zynq_ps/zusp_ps/SAXIGP2/HP0_RSA]
exclude_bd_addr_seg -offset 0xFFCF0000 -range 64K -target_address_space [get_bd_addr_spaces axi_eth_0_dma/Data_S2MM] [get_bd_addr_segs zynq_ps/zusp_ps/SAXIGP2/HP0_MBISTJTAG]
exclude_bd_addr_seg -offset 0xFFD80000 -range 256K -target_address_space [get_bd_addr_spaces axi_eth_0_dma/Data_S2MM] [get_bd_addr_segs zynq_ps/zusp_ps/SAXIGP2/HP0_PMU_GLOBAL]
assign_bd_address -offset 0x00000000 -range 2G -target_address_space [get_bd_addr_spaces axi_eth_0_dma/Data_SG] [get_bd_addr_segs zynq_ps/zusp_ps/SAXIGP2/HP0_DDR_LOW]
assign_bd_address -offset 0xC0000000 -range 512M -target_address_space [get_bd_addr_spaces axi_eth_0_dma/Data_SG] [get_bd_addr_segs zynq_ps/zusp_ps/SAXIGP2/HP0_QSPI]
assign_bd_address -offset 0xE0000000 -range 256M -target_address_space [get_bd_addr_spaces axi_eth_0_dma/Data_SG] [get_bd_addr_segs zynq_ps/zusp_ps/SAXIGP2/HP0_PCIE_LOW]
assign_bd_address -offset 0xFF000000 -range 64K -target_address_space [get_bd_addr_spaces axi_eth_0_dma/Data_SG] [get_bd_addr_segs zynq_ps/zusp_ps/SAXIGP2/HP0_UART0]
assign_bd_address -offset 0xFF010000 -range 64K -target_address_space [get_bd_addr_spaces axi_eth_0_dma/Data_SG] [get_bd_addr_segs zynq_ps/zusp_ps/SAXIGP2/HP0_UART1]
assign_bd_address -offset 0xFF020000 -range 64K -target_address_space [get_bd_addr_spaces axi_eth_0_dma/Data_SG] [get_bd_addr_segs zynq_ps/zusp_ps/SAXIGP2/HP0_I2C0]
assign_bd_address -offset 0xFF030000 -range 64K -target_address_space [get_bd_addr_spaces axi_eth_0_dma/Data_SG] [get_bd_addr_segs zynq_ps/zusp_ps/SAXIGP2/HP0_I2C1]
assign_bd_address -offset 0xFF110000 -range 64K -target_address_space [get_bd_addr_spaces axi_eth_0_dma/Data_SG] [get_bd_addr_segs zynq_ps/zusp_ps/SAXIGP2/HP0_TTC0]
assign_bd_address -offset 0xFF120000 -range 64K -target_address_space [get_bd_addr_spaces axi_eth_0_dma/Data_SG] [get_bd_addr_segs zynq_ps/zusp_ps/SAXIGP2/HP0_TTC1]
assign_bd_address -offset 0xFF130000 -range 64K -target_address_space [get_bd_addr_spaces axi_eth_0_dma/Data_SG] [get_bd_addr_segs zynq_ps/zusp_ps/SAXIGP2/HP0_TTC2]
assign_bd_address -offset 0xFF140000 -range 64K -target_address_space [get_bd_addr_spaces axi_eth_0_dma/Data_SG] [get_bd_addr_segs zynq_ps/zusp_ps/SAXIGP2/HP0_TTC3]
assign_bd_address -offset 0xFF170000 -range 64K -target_address_space [get_bd_addr_spaces axi_eth_0_dma/Data_SG] [get_bd_addr_segs zynq_ps/zusp_ps/SAXIGP2/HP0_SD1]
assign_bd_address -offset 0xFF180000 -range 512K -target_address_space [get_bd_addr_spaces axi_eth_0_dma/Data_SG] [get_bd_addr_segs zynq_ps/zusp_ps/SAXIGP2/HP0_IOUSLCR]
assign_bd_address -offset 0xFF300000 -range 1M -target_address_space [get_bd_addr_spaces axi_eth_0_dma/Data_SG] [get_bd_addr_segs zynq_ps/zusp_ps/SAXIGP2/HP0_IPI]
assign_bd_address -offset 0xFF400000 -range 1M -target_address_space [get_bd_addr_spaces axi_eth_0_dma/Data_SG] [get_bd_addr_segs zynq_ps/zusp_ps/SAXIGP2/HP0_LPD_SLCR]
assign_bd_address -offset 0xFF5E0000 -range 128K -target_address_space [get_bd_addr_spaces axi_eth_0_dma/Data_SG] [get_bd_addr_segs zynq_ps/zusp_ps/SAXIGP2/HP0_CRL_APB]
assign_bd_address -offset 0xFF960000 -range 64K -target_address_space [get_bd_addr_spaces axi_eth_0_dma/Data_SG] [get_bd_addr_segs zynq_ps/zusp_ps/SAXIGP2/HP0_OCM_CTRL]
assign_bd_address -offset 0xFF980000 -range 64K -target_address_space [get_bd_addr_spaces axi_eth_0_dma/Data_SG] [get_bd_addr_segs zynq_ps/zusp_ps/SAXIGP2/HP0_LPD_XPPU]
assign_bd_address -offset 0xFF990000 -range 64K -target_address_space [get_bd_addr_spaces axi_eth_0_dma/Data_SG] [get_bd_addr_segs zynq_ps/zusp_ps/SAXIGP2/HP0_IPI_BUFFERS]
assign_bd_address -offset 0xFF9A0000 -range 64K -target_address_space [get_bd_addr_spaces axi_eth_0_dma/Data_SG] [get_bd_addr_segs zynq_ps/zusp_ps/SAXIGP2/HP0_RPU]
assign_bd_address -offset 0xFF9B0000 -range 64K -target_address_space [get_bd_addr_spaces axi_eth_0_dma/Data_SG] [get_bd_addr_segs zynq_ps/zusp_ps/SAXIGP2/HP0_AFIFM6]
assign_bd_address -offset 0xFF9C0000 -range 64K -target_address_space [get_bd_addr_spaces axi_eth_0_dma/Data_SG] [get_bd_addr_segs zynq_ps/zusp_ps/SAXIGP2/HP0_LPD_XPPU_SINK]
assign_bd_address -offset 0xFFA00000 -range 256K -target_address_space [get_bd_addr_spaces axi_eth_0_dma/Data_SG] [get_bd_addr_segs zynq_ps/zusp_ps/SAXIGP2/HP0_APM]
assign_bd_address -offset 0xFFA50000 -range 64K -target_address_space [get_bd_addr_spaces axi_eth_0_dma/Data_SG] [get_bd_addr_segs zynq_ps/zusp_ps/SAXIGP2/HP0_AMS]
assign_bd_address -offset 0xFFA60000 -range 64K -target_address_space [get_bd_addr_spaces axi_eth_0_dma/Data_SG] [get_bd_addr_segs zynq_ps/zusp_ps/SAXIGP2/HP0_RTC]
assign_bd_address -offset 0xFFA70000 -range 64K -target_address_space [get_bd_addr_spaces axi_eth_0_dma/Data_SG] [get_bd_addr_segs zynq_ps/zusp_ps/SAXIGP2/HP0_OCM_XMPU_CFG]
assign_bd_address -offset 0xFFA80000 -range 512K -target_address_space [get_bd_addr_spaces axi_eth_0_dma/Data_SG] [get_bd_addr_segs zynq_ps/zusp_ps/SAXIGP2/HP0_LDMA]
assign_bd_address -offset 0xFFC80000 -range 128K -target_address_space [get_bd_addr_spaces axi_eth_0_dma/Data_SG] [get_bd_addr_segs zynq_ps/zusp_ps/SAXIGP2/HP0_CSUDMA]
assign_bd_address -offset 0xFFCA0000 -range 64K -target_address_space [get_bd_addr_spaces axi_eth_0_dma/Data_SG] [get_bd_addr_segs zynq_ps/zusp_ps/SAXIGP2/HP0_CSU]
assign_bd_address -offset 0xFFCC0000 -range 64K -target_address_space [get_bd_addr_spaces axi_eth_0_dma/Data_SG] [get_bd_addr_segs zynq_ps/zusp_ps/SAXIGP2/HP0_EFUSE]
assign_bd_address -offset 0xFFCE0000 -range 64K -target_address_space [get_bd_addr_spaces axi_eth_0_dma/Data_SG] [get_bd_addr_segs zynq_ps/zusp_ps/SAXIGP2/HP0_RSA]
assign_bd_address -offset 0xFFCF0000 -range 64K -target_address_space [get_bd_addr_spaces axi_eth_0_dma/Data_SG] [get_bd_addr_segs zynq_ps/zusp_ps/SAXIGP2/HP0_MBISTJTAG]
assign_bd_address -offset 0xFFD80000 -range 256K -target_address_space [get_bd_addr_spaces axi_eth_0_dma/Data_SG] [get_bd_addr_segs zynq_ps/zusp_ps/SAXIGP2/HP0_PMU_GLOBAL]
assign_bd_address -offset 0xFFFC0000 -range 256K -target_address_space [get_bd_addr_spaces axi_eth_0_dma/Data_SG] [get_bd_addr_segs zynq_ps/zusp_ps/SAXIGP2/HP0_OCM]
exclude_bd_addr_seg -offset 0x00000000 -range 1 -target_address_space [get_bd_addr_spaces axi_eth_0_dma/Data_SG] [get_bd_addr_segs zynq_ps/zusp_ps/SAXIGP2/HP0_DDR_HIGH]
exclude_bd_addr_seg -offset 0xFF070000 -range 64K -target_address_space [get_bd_addr_spaces axi_eth_0_dma/Data_SG] [get_bd_addr_segs zynq_ps/zusp_ps/SAXIGP2/HP0_CAN1]
exclude_bd_addr_seg -offset 0xFF0A0000 -range 64K -target_address_space [get_bd_addr_spaces axi_eth_0_dma/Data_SG] [get_bd_addr_segs zynq_ps/zusp_ps/SAXIGP2/HP0_GPIO]
exclude_bd_addr_seg -offset 0xFF0E0000 -range 64K -target_address_space [get_bd_addr_spaces axi_eth_0_dma/Data_SG] [get_bd_addr_segs zynq_ps/zusp_ps/SAXIGP2/HP0_GEM3]
exclude_bd_addr_seg -offset 0xFF0F0000 -range 64K -target_address_space [get_bd_addr_spaces axi_eth_0_dma/Data_SG] [get_bd_addr_segs zynq_ps/zusp_ps/SAXIGP2/HP0_QSPI_CTRL]
exclude_bd_addr_seg -offset 0xFF150000 -range 64K -target_address_space [get_bd_addr_spaces axi_eth_0_dma/Data_SG] [get_bd_addr_segs zynq_ps/zusp_ps/SAXIGP2/HP0_SWDT]
exclude_bd_addr_seg -offset 0xFF240000 -range 64K -target_address_space [get_bd_addr_spaces axi_eth_0_dma/Data_SG] [get_bd_addr_segs zynq_ps/zusp_ps/SAXIGP2/HP0_IOU_SECURE_SLCR]
exclude_bd_addr_seg -offset 0xFF250000 -range 64K -target_address_space [get_bd_addr_spaces axi_eth_0_dma/Data_SG] [get_bd_addr_segs zynq_ps/zusp_ps/SAXIGP2/HP0_IOU_SCNTR]
exclude_bd_addr_seg -offset 0xFF260000 -range 64K -target_address_space [get_bd_addr_spaces axi_eth_0_dma/Data_SG] [get_bd_addr_segs zynq_ps/zusp_ps/SAXIGP2/HP0_IOU_SCNTRS]
exclude_bd_addr_seg -offset 0xFF9D0000 -range 64K -target_address_space [get_bd_addr_spaces axi_eth_0_dma/Data_SG] [get_bd_addr_segs zynq_ps/zusp_ps/SAXIGP2/HP0_USB0]
assign_bd_address -offset 0x00A0000000 -range 256K -target_address_space [get_bd_addr_spaces zynq_ps/zusp_ps/Data] [get_bd_addr_segs axi_eth_0/s_axi/Reg0]
assign_bd_address -offset 0x00A0040000 -range 64K -target_address_space [get_bd_addr_spaces zynq_ps/zusp_ps/Data] [get_bd_addr_segs axi_eth_0_dma/S_AXI_LITE/Reg]
assign_bd_address -offset 0x00A0050000 -range 64K -target_address_space [get_bd_addr_spaces zynq_ps/zusp_ps/Data] [get_bd_addr_segs other_perph/axi_timer_1/S_AXI/Reg]

validate_bd_design
save_bd_design
